# EAGLE design Caprica Charger (EAGLE 6.1)
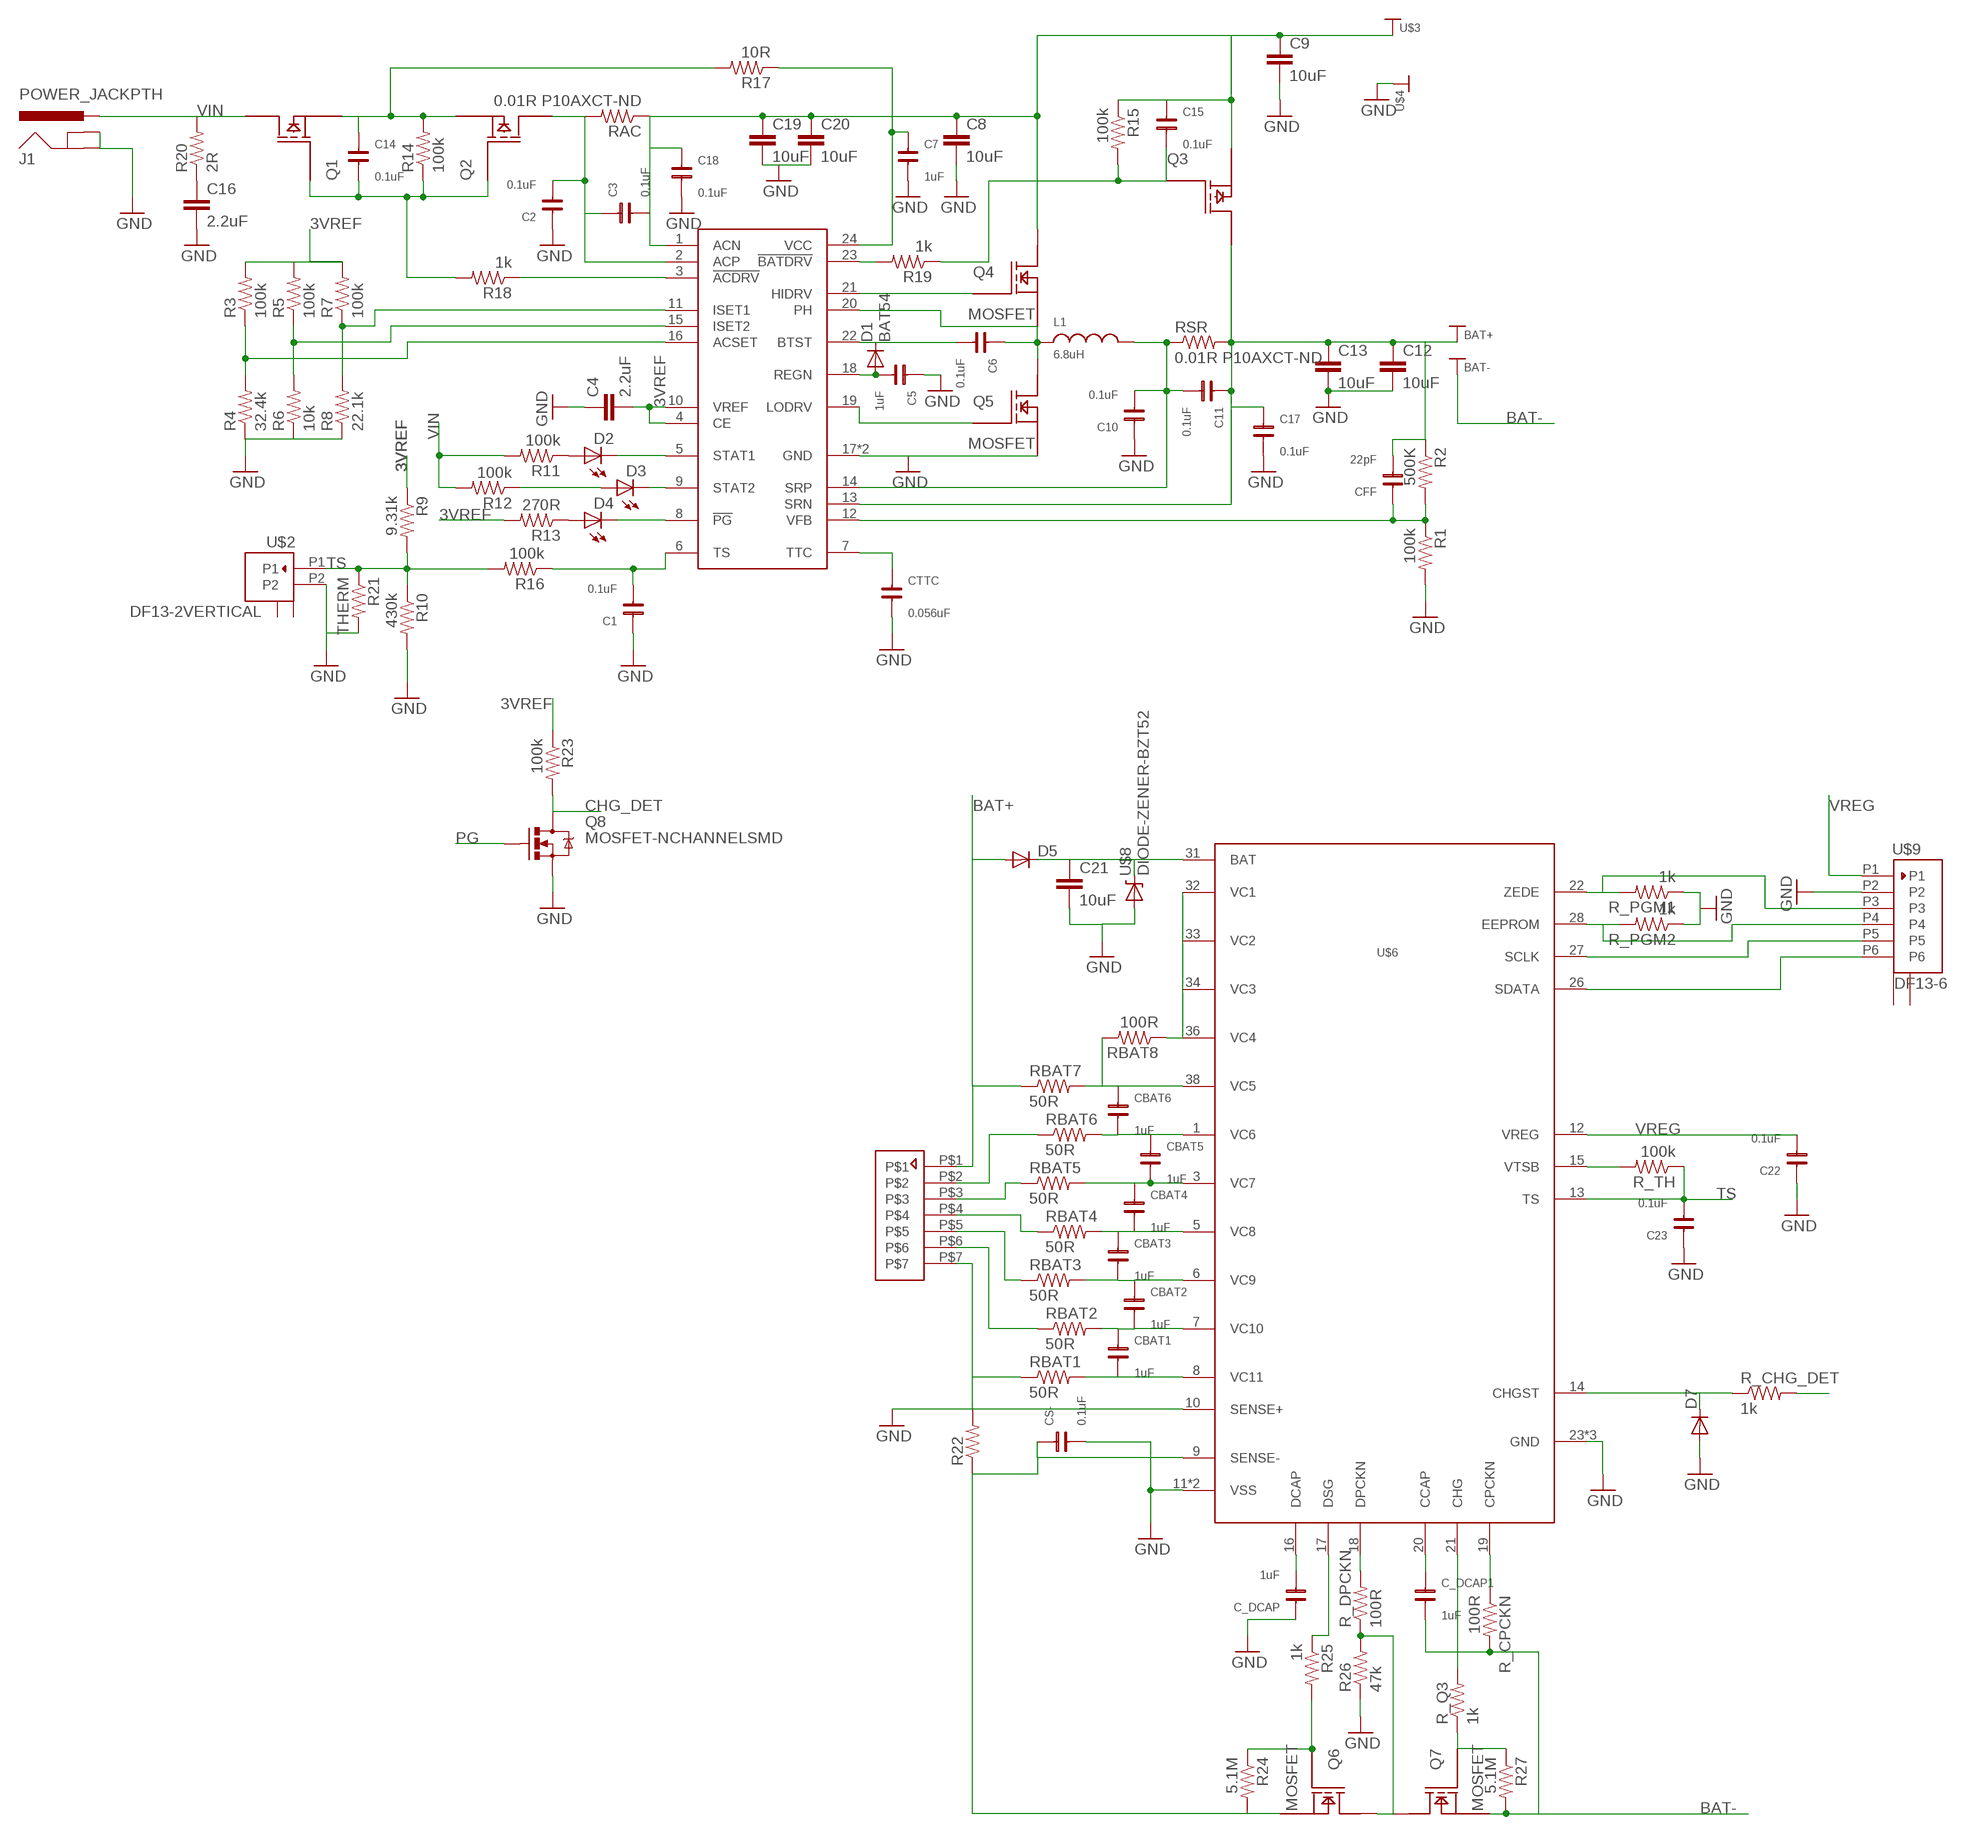
[diagram p0: schematic, sheet 1]

## Parts
BAT+  HIGHCURRENTPAD2  [HIGH_CURRENT_PAD2]
BAT-  HIGHCURRENTPAD2  [HIGH_CURRENT_PAD2]
C1  0.1uF  CAPACITOR0603-CAP  [0603-CAP]
C2  0.1uF  CAPACITOR0603-CAP  [0603-CAP]
C3  0.1uF  CAPACITOR0603-CAP  [0603-CAP]
C4  2.2uF  CAP1206  [1206]
C5  1uF  CAPACITOR0603-CAP  [0603-CAP]
C6  0.1uF  CAPACITOR0603-CAP  [0603-CAP]
C7  1uF  CAPACITOR0603-CAP  [0603-CAP]
C8  10uF  CAP1206  [1206]
C9  10uF  CAP1206  [1206]
C10  0.1uF  CAPACITOR0603-CAP  [0603-CAP]
C11  0.1uF  CAPACITOR0603-CAP  [0603-CAP]
C12  10uF  CAP1206  [1206]
C13  10uF  CAP1206  [1206]
C14  0.1uF  CAPACITOR0603-CAP  [0603-CAP]
C15  0.1uF  CAPACITOR0603-CAP  [0603-CAP]
C16  2.2uF  CAP1206  [1206]
C17  0.1uF  CAPACITOR0603-CAP  [0603-CAP]
C18  0.1uF  CAPACITOR0603-CAP  [0603-CAP]
C19  10uF  CAP1206  [1206]
C20  10uF  CAP1206  [1206]
C21  10uF  CAP1206  [1206]
C22  0.1uF  CAPACITOR0603-CAP  [0603-CAP]
C23  0.1uF  CAPACITOR0603-CAP  [0603-CAP]
C_DCAP  1uF  CAPACITOR0603-CAP  [0603-CAP]
C_DCAP1  1uF  CAPACITOR0603-CAP  [0603-CAP]
CBAT1  1uF  CAPACITOR0603-CAP  [0603-CAP]
CBAT2  1uF  CAPACITOR0603-CAP  [0603-CAP]
CBAT3  1uF  CAPACITOR0603-CAP  [0603-CAP]
CBAT4  1uF  CAPACITOR0603-CAP  [0603-CAP]
CBAT5  1uF  CAPACITOR0603-CAP  [0603-CAP]
CBAT6  1uF  CAPACITOR0603-CAP  [0603-CAP]
CFF  22pF  CAPACITOR0603-CAP  [0603-CAP]
CS-  0.1uF  CAPACITOR0603-CAP  [0603-CAP]
CTTC  0.056uF  CAPACITOR0603-CAP  [0603-CAP]
D1  BAT54  DIODESOT23  [SOT23-3]
D2  LED1206  [LED-1206]
D3  LED1206  [LED-1206]
D4  LED1206  [LED-1206]
D5  DIODESMA  [SMA-DIODE]
D7  DIODESOD  [SOD-323]
J1  POWER_JACKPTH  [POWER_JACK_PTH]
L1  6.8uH  INDUCTORSDR0403  [SDR0403_INDUCTOR]
Q1  MOSFET_PCH  [POWERPAK_1212-8]
Q2  MOSFET_PCH  [POWERPAK_1212-8]
Q3  MOSFET_PCH  [POWERPAK_1212-8]
Q4  MOSFET  [POWERPAK_1212-8]
Q5  MOSFET  [POWERPAK_1212-8]
Q6  MOSFET  [POWERPAK_1212-8]
Q7  MOSFET  [POWERPAK_1212-8]
Q8  MOSFET-NCHANNELSMD  [SOT23-3]
R1  100k  RESISTOR  [0603-RES]
R2  500K  RESISTOR  [0603-RES]
R3  100k  RESISTOR  [0603-RES]
R4  32.4k  RESISTOR  [0603-RES]
R5  100k  RESISTOR  [0603-RES]
R6  10k  RESISTOR  [0603-RES]
R7  100k  RESISTOR  [0603-RES]
R8  22.1k  RESISTOR  [0603-RES]
R9  9.31k  RESISTOR  [0603-RES]
R10  430k  RESISTOR  [0603-RES]
R11  100k  RESISTOR  [0603-RES]
R12  100k  RESISTOR  [0603-RES]
R13  270R  RESISTOR  [0603-RES]
R14  100k  RESISTOR  [0603-RES]
R15  100k  RESISTOR  [0603-RES]
R16  100k  RESISTOR  [0603-RES]
R17  10R  RESISTOR  [0603-RES]
R18  1k  RESISTOR  [0603-RES]
R19  1k  RESISTOR  [0603-RES]
R20  2R  RESISTOR  [0603-RES]
R21  THERM  RESISTOR  [0603-RES]
R22  RESISTOROHMITE  [OHMITE_FCSL64_CURRENT_SENSE_RESISTOR]
R23  100k  RESISTOR  [0603-RES]
R24  5.1M  RESISTOR  [0603-RES]
R25  1k  RESISTOR  [0603-RES]
R26  47k  RESISTOR  [0603-RES]
R27  5.1M  RESISTOR  [0603-RES]
R_CHG_DET  1k  RESISTOR  [0603-RES]
R_CPCKN  100R  RESISTOR  [0603-RES]
R_DPCKN  100R  RESISTOR  [0603-RES]
R_PGM1  1k  RESISTOR  [0603-RES]
R_PGM2  1k  RESISTOR  [0603-RES]
R_Q3  1k  RESISTOR  [0603-RES]
R_TH  100k  RESISTOR  [0603-RES]
RAC  0.01R P10AXCT-ND  RESISTOR  [0603-RES]
RBAT1  50R  RESISTOR  [0603-RES]
RBAT2  50R  RESISTOR  [0603-RES]
RBAT3  50R  RESISTOR  [0603-RES]
RBAT4  50R  RESISTOR  [0603-RES]
RBAT5  50R  RESISTOR  [0603-RES]
RBAT6  50R  RESISTOR  [0603-RES]
RBAT7  50R  RESISTOR  [0603-RES]
RBAT8  100R  RESISTOR  [0603-RES]
RSR  0.01R P10AXCT-ND  RESISTOR  [0603-RES]
U$1  BQ24610_LIPO_CHARGER  [QFN-24_ALT2]
U$2  DF13-2VERTICAL  [DF13-2-VERT]
U$3  HIGHCURRENTPAD2  [HIGH_CURRENT_PAD2]
U$4  HIGHCURRENTPAD2  [HIGH_CURRENT_PAD2]
U$6  BQ77910A_BATTERY_PROTECTOR  [TSSOP38]
U$7  JST_XH_7  [B7B-XH]
U$8  DIODE-ZENER-BZT52  [SOD-323]
U$9  DF13-6  [DF13-6-VERT]

## Nets
3VREF: C4.2 R3.2 R5.2 R7.2 R9.1 R13.2 R23.1 U$1.4(CE) U$1.10(VREF)
BAT+: BAT+.P$1 C11.1 C12.1 C13.1 C17.1 CFF.2 D5.A Q3.P5(DRAIN) Q3.P6(DRAIN) Q3.P7(DRAIN) Q3.P8(DRAIN) Q3.PAD(DRAIN) R2.1 RBAT7.1 RSR.2 U$1.13(SRN) U$7.P$1
BAT-: BAT-.P$1 C_DCAP1.2 Q7.P1(S) Q7.P2(S) Q7.P3(S) R27.2 R_CPCKN.2
CHG_DET: Q8.3(D) R23.2 R_CHG_DET.2
GND: C1.1 C2.1 C4.1 C5.1 C7.2 C8.2 C9.2 C10.1 C12.2 C13.2 C16.2 C17.2 C18.2 C19.2 C20.2 C21.2 C22.1 C23.1 C_DCAP.1 CS-.2 CTTC.2 D7.2(A) J1.GND J1.GNDBREAK Q5.P1(S) Q5.P2(S) Q5.P3(S) Q8.2(S) R1.2 R4.1 R6.1 R8.1 R10.2 R21.2 R22.P$2 R26.1 R_PGM1.1 R_PGM2.1 RBAT1.1 U$1.17(GND) U$1.EP(GND) U$2.P2 U$4.P$1 U$6.10(SENSE+) U$6.11(VSS) U$6.23(GND) U$6.24(GND) U$6.25(GND) U$6.29(VSS) U$7.P$7 U$8.2(A) U$9.P2
HIDRV: Q4.P4(G) U$1.21(HIDRV)
N$1: D2.A R11.1
N$2: C14.1 Q1.P1(SOURCE) Q1.P2(SOURCE) Q1.P3(SOURCE) Q2.P1(SOURCE) Q2.P2(SOURCE) Q2.P3(SOURCE) R14.2 R17.2
N$3: C14.2 Q1.P4(GATE) Q2.P4(GATE) R14.1 R18.2
N$4: C2.2 C3.1 Q2.P5(DRAIN) Q2.P6(DRAIN) Q2.P7(DRAIN) Q2.P8(DRAIN) Q2.PAD(DRAIN) RAC.2 U$1.2(ACP)
N$5: CBAT1.1 CBAT2.2 RBAT2.2 U$6.7(VC10)
N$6: R18.1 U$1.3(!ACDRV!)
N$7: C16.1 R20.1
N$8: C7.1 R17.1 U$1.24(VCC)
N$9: R5.1 R6.2 U$1.15(ISET2)
N$10: D2.C U$1.5(STAT1)
N$11: D3.C U$1.9(STAT2)
N$12: R25.1 U$6.17(DSG)
N$13: D3.A R12.1
N$14: D4.A R13.1
N$15: R3.1 R4.2 U$1.16(ACSET)
N$16: R7.1 R8.2 U$1.11(ISET1)
N$17: CBAT2.1 CBAT3.2 RBAT3.2 U$6.6(VC9)
N$18: C1.2 R16.1 U$1.6(TS)
N$19: CTTC.1 U$1.7(TTC)
N$20: R19.2 U$1.23(!BATDRV!)
N$21: C15.2 Q3.P4(GATE) R15.2 R19.1
N$22: CBAT3.1 CBAT4.2 RBAT4.2 U$6.5(VC8)
N$23: CBAT1.2 RBAT1.2 U$6.8(VC11)
N$24: C6.1 L1.P$1 Q4.P1(S) Q4.P2(S) Q4.P3(S) Q5.P5(D) Q5.P6(D) Q5.P7(D) Q5.P8(D) Q5.PAD(D) U$1.20(PH)
N$25: C10.2 C11.2 L1.P$2 RSR.1 U$1.14(SRP)
N$26: C6.2 D1.3(C) U$1.22(BTST)
N$27: C5.2 D1.1(A) U$1.18(REGN)
N$28: Q5.P4(G) U$1.19(LODRV)
N$29: CBAT5.1 CBAT6.2 RBAT6.2 U$6.1(VC6)
N$30: CFF.1 R1.1 R2.2 U$1.12(VFB)
N$31: CBAT4.1 CBAT5.2 RBAT5.2 U$6.3(VC7)
N$32: C_DCAP.2 U$6.16(DCAP)
N$33: CBAT6.1 RBAT7.2 RBAT8.2 U$6.38(VC5)
N$34: RBAT8.1 U$6.32(VC1) U$6.33(VC2) U$6.34(VC3) U$6.36(VC4)
N$35: C21.1 D5.C U$6.31(BAT) U$8.1(C)
N$37: D7.1(C) R_CHG_DET.1 U$6.14(CHGST)
N$38: RBAT2.1 U$7.P$6
N$39: RBAT3.1 U$7.P$5
N$40: RBAT4.1 U$7.P$4
N$41: Q6.P4(G) R24.1 R25.2
N$42: RBAT6.1 U$7.P$2
N$43: RBAT5.1 U$7.P$3
N$44: R_DPCKN.2 U$6.18(DPCKN)
N$46: Q6.P5(D) Q6.P6(D) Q6.P7(D) Q6.P8(D) Q6.PAD(D) Q7.P5(D) Q7.P6(D) Q7.P7(D) Q7.P8(D) Q7.PAD(D) R26.2 R_DPCKN.1
N$47: U$6.27(SCLK) U$9.P5
N$48: CS-.1 Q6.P1(S) Q6.P2(S) Q6.P3(S) R22.P$1 R24.2 U$6.9(SENSE-)
N$49: C_DCAP1.1 U$6.20(CCAP)
N$50: R_Q3.2 U$6.21(CHG)
N$51: Q7.P4(G) R27.1 R_Q3.1
N$52: U$6.26(SDATA) U$9.P6
N$53: R_CPCKN.1 U$6.19(CPCKN)
N$54: R_PGM2.2 U$6.28(EEPROM) U$9.P4
N$55: R_TH.2 U$6.15(VTSB)
N$57: R_PGM1.2 U$6.22(ZEDE) U$9.P3
PG: D4.C Q8.1(G) U$1.8(!PG!)
SYS+: C3.2 C8.1 C9.1 C15.1 C18.1 C19.1 C20.1 Q3.P1(SOURCE) Q3.P2(SOURCE) Q3.P3(SOURCE) Q4.P5(D) Q4.P6(D) Q4.P7(D) Q4.P8(D) Q4.PAD(D) R15.1 RAC.1 U$1.1(ACN) U$3.P$1
TS: C23.2 R9.2 R10.1 R16.2 R21.1 R_TH.1 U$2.P1 U$6.13(TS)
VIN: J1.PWR Q1.P5(DRAIN) Q1.P6(DRAIN) Q1.P7(DRAIN) Q1.P8(DRAIN) Q1.PAD(DRAIN) R11.2 R12.2 R20.2
VREG: C22.2 U$6.12(VREG) U$9.P1
Unconnected: U$2.P$6(TAB) U$2.P$7(TAB) U$9.P$6 U$9.P$7

## Library data of the parts
BAT+ BAT- U$3 U$4 = Taylor:HIGHCURRENTPAD2
C1-C3 C5-C7 C10 C11 C14 C15 C17 C18 C22 C23 C_DCAP C_DCAP1 CBAT1-CBAT6 CFF CS- CTTC = Taylor:CAPACITOR
C4 C8 C9 C12 C13 C16 C19-C21 = SparkFun:CAP: Capacitor Standard 0603 ceramic capacitor, and 0.1" leaded capacitor.
D1 D5 D7 = SparkFun:DIODE: Diode These are standard reverse protection diodes and small signal diodes. SMA package can handle up to about 1A. SOD-323 can handle about 200mA. What the SOD-323 package when ordering, there are some mfgs out there that are 5-pin packages.
D2-D4 = SparkFun:LED: LEDs Standard schematic elements and footprints for 5mm, 3mm, 1206, and 0603 sized LEDs. 5mm - Spark Fun Electronics SKU : COM-00529 (and others)
J1 = SparkFun:POWER_JACK: Power Jack This is the standard 5.5mm barrel jack for power. The PTH is the most common, proven, reliable, footprint. All others are experimental. The Slot footprint only works if the mill layer is transmitted to the PCB fab house so be warned. Spark Fun Electronics SKU : PRT-00119. Mating wall wart : TOL-00298 (and others)
L1 = Taylor:INDUCTOR: SRR1260_SMD_INDUCTOR http://www.bourns.com/data/global/PDFs/SRR1260.pdf 1uH-1000uH
Q1-Q3 = Taylor:MOSFET_PCH
Q4-Q7 = Taylor:MOSFET
Q8 = SparkFun:MOSFET-NCHANNEL
R1-R27 R_CHG_DET R_CPCKN R_DPCKN R_PGM1 R_PGM2 R_Q3 R_TH RAC RBAT1-RBAT8 RSR = Taylor:RESISTOR: Resistor Basic schematic elements and footprints for 0603, 1206, and PTH 1/10th watt (small) resistors.
U$1 = Taylor:BQ24610_LIPO_CHARGER
U$2 = Taylor:DF13-2
U$6 = Taylor:BQ77910A_BATTERY_PROTECTOR
U$7 = Taylor:JST_XH_7
U$8 = SparkFun:DIODE-ZENER: Zener Diode Production Part - 8199 3.4V Zener Voltage
U$9 = Taylor:DF13-6

## Board
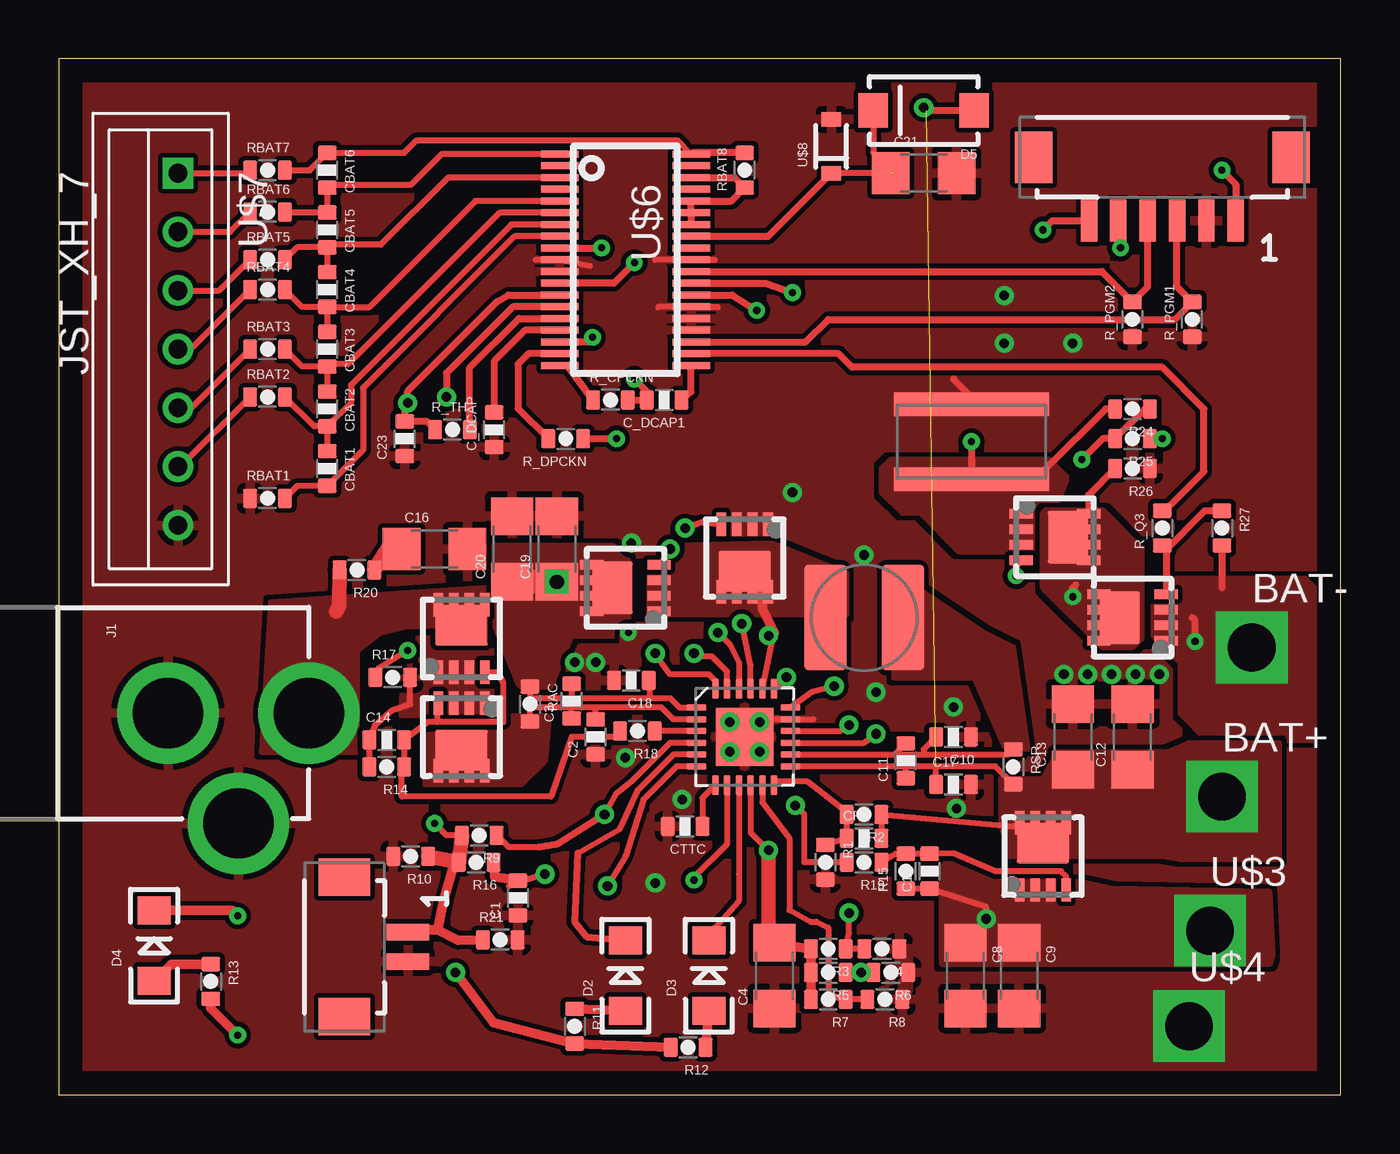
[diagram p1: board, top side]
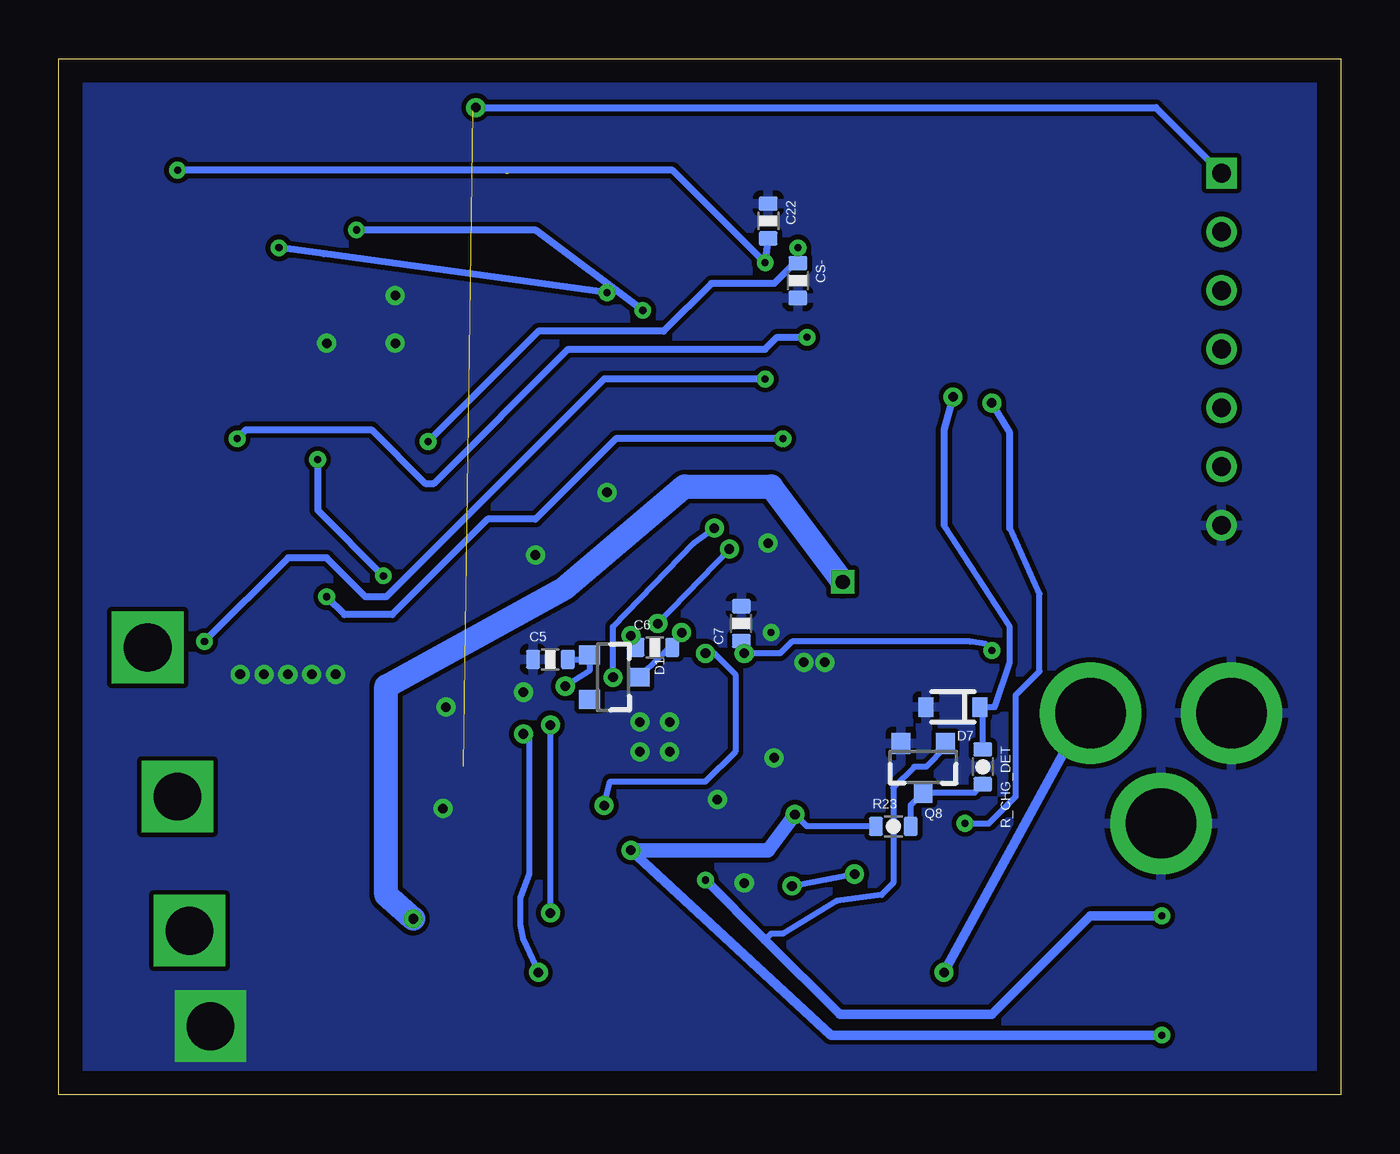
[diagram p2: board, bottom side, seen from below]

Size 54.59 x 44.12 mm. Coordinates in mm from the lower left corner, seen from the top.
Outline: 0,0 54.59,0 54.59,44.12 0,44.12 0,0
Copper layers (1*16): Top 0.035mm / dielectric 1.5mm / Bottom 0.035mm
Design rules: minimum track width 10mil, minimum drill 24mil, track to track 8mil, track to pad 8mil, pad to pad 8mil, via to via 8mil, smd to smd 8mil, copper to edge 40mil, drill to drill 8mil, minimum pad ring 10mil, minimum via ring 8mil, stop-mask expansion 4mil, vias tented up to drill 0mil, thermal gap 10mil

### Footprints (pad centres in the part's own frame; a part is rotated, then mirrored left to right if it is on the bottom)
HIGH_CURRENT_PAD2 = drill 2.032 pad 2.54 square: P$1 0,0
0603-CAP = smd 0.6 x 0.8: 1 -0.74,0; 2 0.74,0
1206 = smd 1.6 x 1.8: 1 -1.4,0; 2 1.4,0
SOT23-3 = smd 0.8 x 0.9: 1 -0.95,-1; 2 0.95,-1; 3 0,1.1
LED-1206 = smd 1.2 x 1.4: A -1.5,0; C 1.5,0
SMA-DIODE = smd 1.27 x 1.47: A -2.15,0; C 2.15,0
SOD-323 = smd 0.63 x 0.83: 1 -1.15,0; 2 1.15,0
POWER_JACK_PTH = drill 2.997 pad 4.318: GND 0,7.7; GNDBREAK 4.7,10.7; PWR 0,13.7
SDR0403_INDUCTOR = smd 1.803 x 4.496: P$1 -1.651,0; P$2 1.651,0
POWERPAK_1212-8 = smd 0.405 x 0.99: P1 0.99,1.435; P2 0.33,1.435; P3 -0.33,1.435; P4 -0.99,1.435; P5 -0.99,-1.435; P6 -0.33,-1.435; P7 0.33,-1.435; P8 0.99,-1.435 | smd 2.235 x 1.725: PAD 0,-0.557
0603-RES = smd 0.6 x 0.8: 1 -0.74,0; 2 0.74,0
OHMITE_FCSL64_CURRENT_SENSE_RESISTOR = smd 1 x 6.6: P$1 -1.6,0; P$2 1.6,0
QFN-24_ALT2 = smd 0.85 x 0.28: 1 -2.05,1.25; 2 -2.05,0.75; 3 -2.05,0.25; 4 -2.05,-0.25; 5 -2.05,-0.75; 6 -2.05,-1.25; 13 1.95,-1.25; 14 1.95,-0.75; 15 1.95,-0.25; 16 1.95,0.25; 17 1.95,0.75; 18 1.95,1.25 | smd 0.28 x 0.85: 7 -1.25,-2.05; 8 -0.75,-2.05; 9 -0.25,-2.05; 10 0.25,-2.05; 11 0.75,-2.05; 12 1.25,-2.05; 19 1.25,2.05; 20 0.75,2.05; 21 0.25,2.05; 22 -0.25,2.05; 23 -0.75,2.05; 24 -1.25,2.05 | smd 2.45 x 2.45: EP 0,0
DF13-2-VERT = smd 1.8 x 0.7: P1 -0.9,-0.575; P2 -0.9,0.675 | smd 2.2 x 1.6: P$6 1.8,3.025; P$7 1.8,-2.925
TSSOP38 = smd 0.3 x 1.6: 1 -4.5,-2.8; 2 -4,-2.8; 3 -3.5,-2.8; 4 -3,-2.8; 5 -2.5,-2.8; 6 -2,-2.8; 7 -1.5,-2.8; 8 -1,-2.8; 9 -0.5,-2.8; 10 0,-2.8; 11 0.5,-2.8; 12 1,-2.8; 13 1.5,-2.8; 14 2,-2.8; 15 2.5,-2.8; 16 3,-2.8; 17 3.5,-2.8; 18 4,-2.8; 19 4.5,-2.8; 20 4.5,2.8; 21 4,2.8; 22 3.5,2.8; 23 3,2.8; 24 2.5,2.8; 25 2,2.8; 26 1.5,2.8; 27 1,2.8; 28 0.5,2.8; 29 0,2.8; 30 -0.5,2.8; 31 -1,2.8; 32 -1.5,2.8; 33 -2,2.8; 34 -2.5,2.8; 35 -3,2.8; 36 -3.5,2.8; 37 -4,2.8; 38 -4.5,2.8
B7B-XH = drill 0.8 square: P$1 -7.5,0 | drill 0.8: P$2 -5,0; P$3 -2.5,0; P$4 0,0; P$5 2.5,0; P$6 5,0; P$7 7.5,0
DF13-6-VERT = smd 1.8 x 0.7: P1 -2.15,-3.125; P2 -2.15,-1.875; P3 -2.15,-0.625; P4 -2.15,0.625; P5 -2.15,1.875; P6 -2.15,3.125 | smd 2.2 x 1.6: P$6 0.55,5.475; P$7 0.55,-5.475

### Placement (x,y rotation side)
BAT+  49.53,12.7 0 top
BAT-  50.8,19.05 0 top
C1  19.56,8.38 90 top
C2  22.86,15.24 90 top
C3  21.84,16.76 90 top
C4  30.48,5.08 90 top
C5  33.66,18.54 0 bottom
C6  29.21,19.05 0 bottom
C7  25.53,20.07 90 bottom
C8  38.61,5.08 270 top
C9  40.89,5.08 270 top
C10  38.1,15.24 180 top
C11  36.07,14.22 90 top
C12  45.72,15.24 90 top
C13  43.18,15.24 90 top
C14  13.97,15.11 0 top
C15  37.08,9.53 90 top
C16  16,23.24 0 top
C17  38.1,13.21 0 top
C18  24.38,17.65 180 top
C19  21.21,23.24 90 top
C20  19.3,23.24 90 top
C21  36.83,39.24 0 top
C22  24.38,37.21 270 bottom
C23  14.73,27.94 90 top
C_DCAP  18.54,28.32 90 top
C_DCAP1  25.78,29.59 180 top
CBAT1  11.43,26.67 270 top
CBAT2  11.43,29.21 270 top
CBAT3  11.43,31.75 270 top
CBAT4  11.43,34.29 270 top
CBAT5  11.43,36.83 270 top
CBAT6  11.43,39.37 270 top
CFF  34.29,10.92 0 top
CS-  23.11,34.67 270 bottom
CTTC  26.67,11.43 180 top
D1  30.99,17.78 270 bottom
D2  24.13,5.08 90 top
D3  27.69,5.08 90 top
D4  4.06,6.35 90 top
D5  36.83,41.91 180 top
D7  16.51,16.51 180 bottom
J1  -3.05,16.26 270 top
L1  34.29,20.32 0 top
Q1  17.14,19.43 180 top
Q2  17.14,15.24 0 top
Q3  41.91,10.16 180 top
Q4  24.13,21.59 270 top
Q5  29.21,22.86 0 top
Q6  42.42,23.75 90 top
Q7  45.72,20.32 270 top
Q8  17.78,13.97 180 bottom
R1  32.64,9.91 270 top
R2  34.29,11.94 180 top
R3  32.77,6.22 180 top
R4  35.05,6.22 180 top
R5  32.77,5.21 180 top
R6  35.43,5.21 180 top
R7  32.77,4.06 180 top
R8  35.18,4.06 180 top
R9  17.91,11.05 180 top
R10  14.99,10.16 180 top
R11  21.97,2.92 270 top
R12  26.8,2.03 180 top
R13  6.48,4.83 270 top
R14  13.97,13.97 180 top
R15  36.07,9.53 90 top
R16  17.78,9.91 180 top
R17  14.22,17.78 0 top
R18  24.64,15.49 180 top
R19  34.29,9.91 180 top
R20  12.7,22.35 180 top
R21  18.8,6.6 0 top
R22  38.86,27.81 90 top
R23  19.05,11.43 0 bottom
R24  45.72,29.21 180 top
R25  45.72,27.94 180 top
R26  45.72,26.67 180 top
R27  49.53,24.13 270 top
R_CHG_DET  15.24,13.97 270 bottom
R_CPCKN  23.5,29.59 0 top
R_DPCKN  21.59,27.94 180 top
R_PGM1  48.26,33.02 90 top
R_PGM2  45.72,33.02 90 top
R_Q3  46.99,24.13 90 top
R_TH  16.76,28.32 0 top
RAC  20.07,16.64 270 top
RBAT1  8.89,25.4 0 top
RBAT2  8.89,29.72 0 top
RBAT3  8.89,31.75 0 top
RBAT4  8.89,34.29 0 top
RBAT5  8.89,35.56 0 top
RBAT6  8.89,37.59 0 top
RBAT7  8.89,39.37 0 top
RBAT8  29.21,39.37 90 top
RSR  40.64,13.97 270 top
U$1  29.21,15.24 0 top
U$2  13.97,6.35 180 top
U$3  49.02,6.99 0 top
U$4  48.13,2.92 0 top
U$6  24.13,35.56 270 top
U$7  5.08,31.75 270 top
U$8  32.89,40.39 90 top
U$9  46.99,39.37 90 top

### Tracks (layer width: path | path; a pad name or v marks a point on that pad's centre or on a via)
3VREF  (via drill 0.3, 0.41)
  Top 0.254: U$1.4 26.04,14.99 24.38,13.34 23.75,12.83 v23.24,11.94 | U$1.10 29.46,11.18 v30.23,10.41 | 20.45,10.54 19.18,10.54 18.67,11.05 R9.1
  Top 0.305: v23.24,11.94 21.21,10.67 20.45,10.54
  Top 0.406: R7.2 R5.2 R3.2 31.9,6.23 C4.2 | R13.2 6.48,3.68 v7.62,2.54
  Top 0.61: C4.2 30.42,6.11 30.23,6.73 v30.23,10.41
  Bottom 0.254: R23.1 22.73,11.43 v23.24,11.94
  Bottom 0.406: v7.62,2.54 21.72,2.54 v30.23,10.41
  Bottom 0.61: v30.23,10.41 24.38,10.41 v23.24,11.94
BAT+  (via drill 0.41)  (1 unrouted)
  Top 0.254: RSR.2 39.88,13.99 37.36,13.99 | 37.36,13.99 36.07,13.99 | 36.07,13.99 U$1.13 | C11.1 36.07,13.99 | C17.1 37.36,13.99 | 40.64,11.43 R2.1 CFF.2 | U$7.P$1 8.03,39.25 RBAT7.1
  Top 0.305: D5.A 36.96,41.91 v36.83,42.04
  Bottom 0.305: v36.83,42.04 7.87,42.04 U$7.P$1
  pour Top (no thermals): 40.13,13.46 41.91,13.46 42.55,14.61 42.55,14.48 42.67,14.61 47.24,14.61 48.13,14.99 51.94,14.99 51.94,10.03 47.75,10.03 46.99,10.16 40.51,10.16 40.13,11.56
BAT-  (via drill 0.3)
  Top 0.305: R27.2 49.53,21.59 | R_CPCKN.2 C_DCAP1.2 25.04,29.95 v24.51,30.48 | v48.39,19.3 48.39,20.19 48.26,20.32
  Bottom 0.305: v24.51,30.48 31.37,30.48 40.64,21.21 41.53,21.21 43.18,22.86 44.83,22.86 v48.39,19.3
  pour Top (rank 2, no thermals): 46.61,21.72 46.61,19.56 47.75,18.41 47.75,16.26 48.9,15.11 53.98,15.11 54.23,15.37 54.23,20.83 53.09,21.97 46.86,21.97
CHG_DET
  Bottom 0.254: R23.2 18.31,12.34 Q8.3 15.6,12.87 R_CHG_DET.2
GND  (via drill 0.3, 0.41)
  Top 0.254: 32.13,16 U$1.17 31.13,15.99 31.11,16 | v29.84,15.88 30.35,16 31.11,16 | 31.11,16 31.24,16 | U$1.EP v28.57,14.61 | 20.32,35.56 U$6.10 22.61,35.31 | 25.4,35.56 U$6.29 27.94,35.56 | 28.07,33.53 28.04,33.56 U$6.25 25.56,33.56 25.53,33.53
  Top 0.305: R22.P$2 38.86,29.72 38.1,30.48
  other vias: 38.1,16.51 28.57,15.88 29.84,14.61 38.23,12.19 21.97,18.41 24.26,19.68 22.86,18.41 26.54,12.57 25.4,9.02 34.29,22.99 31.24,25.65 24.13,14.35 24.38,23.5 34.8,17.14 42.8,17.91 43.81,17.91 44.83,17.91 45.85,17.91 46.86,17.91 40.26,32 43.18,32 40.26,34.04
  pour Bottom (rank 2): 0,0 54.61,0 54.61,44.45 0,44.45
  pour Top (rank 3): 0,0 77.47,0 77.47,58.42 0,58.42
HIDRV  (via drill 0.41)
  Top 0.254: U$1.21 29.46,18.29 v29.08,20.07 | v26.04,23.24 25.97,22.99 Q4.P4
  Bottom 0.254: v29.08,20.07 v26.04,23.24
N$1
  Top 0.406: D2.A R11.1
N$2
  Top 0.254: R14.2 C14.1 13.48,15.77 14.22,16.38 14.96,16.64 R17.2
  pour Top: 14.73,19.43 18.41,19.56 18.41,16.26 14.61,16.13
N$3
  Top 0.254: Q1.P4 18.71,18 18.92,17.53 18.92,15.88 16.13,15.88 | 16.13,15.88 16.13,16.51 | 16.13,16.51 16.13,16.64 | Q2.P4 16.16,16.64 16.13,16.51 | 16.13,15.88 15.73,15.88 C14.2 R14.1 14.61,14.07 14.61,12.7 20.95,12.7 21.84,15.24 23.62,15.24 R18.2
N$4
  Top 0.254: RAC.2 20.07,16.51 21.84,16.51 | 21.84,16.51 22.86,16.51 | 22.86,16.51 25.65,16.51 26.16,16 27.15,16 U$1.2 | C3.1 21.84,16.51 | C2.2 22.86,16.51
  pour Top (no thermals): 15.62,15.37 18.16,15.24 19.05,16.13 20.83,16.13 20.83,15.75 20.7,14.22 19.68,13.21 15.62,13.21
N$5
  Top 0.254: CBAT2.2 10.88,28.47 RBAT2.2 | CBAT2.2 CBAT1.1 | U$6.7 19.28,37.06 12.45,30.23 12.45,29.49 CBAT2.2
N$6
  Top 0.254: U$1.3 25.4,15.49 25.5,15.47 | R18.1 25.5,15.47 | 25.5,15.47 25.53,15.62
N$7
  Top 0.61: R20.1 14.33,23.75 C16.1
N$8  (via drill 0.3, 0.41)
  Top 0.254: U$1.24 27.96,17.63 27.69,17.91 26.04,17.91 v25.4,18.8 | v14.86,18.92 13.61,18.16 R17.1
  Bottom 0.254: C7.1 25.53,18.95 v25.4,18.8 23.88,18.8 23.37,19.3 15.79,19.3 15.13,19.2 v14.86,18.92
N$9  (via drill 0.41)
  Top 0.254: U$1.15 34.29,14.99 v34.8,15.37 | R6.2 v34.16,5.21 R5.1
  Bottom 0.254: v34.16,5.21 34.8,6.6 34.92,7.24 34.92,8.38 34.54,9.4 34.54,15.11 v34.8,15.37
N$10
  Top 0.254: U$1.5 26.17,14.49 24.64,12.95 23.88,11.3 22.1,10.29
  Top 0.305: 22.1,10.29 21.97,7.37 22.48,6.73 D2.C 24.13,6.86
N$11
  Top 0.254: U$1.9 28.96,9.39 28.96,8.26 27.94,7.11 D3.C
N$12  (via drill 0.3)
  Top 0.305: R25.1 v46.99,27.94 | v22.73,32.26 22.54,32.06 U$6.17
  Bottom 0.305: v46.99,27.94 46.61,28.32 41.27,28.32 38.99,26.04 38.61,26.04 32.89,31.75 24.51,31.75 24,32.26 v22.73,32.26
N$13
  Top 0.406: D3.A R12.1
N$14
  Top 0.406: R13.1 4.78,5.57 D4.A
N$15  (via drill 0.41)
  Top 0.254: U$1.16 33.27,15.49 v33.66,15.75 | R4.2 R3.1 33.66,6.88 v33.66,7.75
  Bottom 0.254: v33.66,7.75 v33.66,15.75
N$16
  Top 0.254: U$1.11 29.96,12.46 31.11,10.92 31.11,7.87 32,7.37 32.26,7.37 32.77,7.11 32.77,4.32 33.4,4.06 R7.1 R8.2
N$17
  Top 0.254: CBAT3.2 10.37,31.01 RBAT3.2 | CBAT3.2 CBAT2.1 | U$6.6 18.76,37.56 12.32,31.11 11.54,31.11 CBAT3.2
N$18  (via drill 0.41)
  Top 0.254: U$1.6 26.31,13.99 24.89,12.57 24.13,10.16 v23.37,8.89 | v20.7,9.4 19.16,8.89 C1.2
  Top 0.406: C1.2 18.56,9.27 R16.1
  Bottom 0.254: v23.37,8.89 v20.7,9.4
N$19
  Top 0.254: U$1.7 27.41,12.64 CTTC.1
N$20  (via drill 0.41)
  Top 0.254: U$1.23 28.46,18.02 27.81,18.67 27.18,18.67 v27.05,18.8 | R19.2 33.42,9.88 33.53,9.91 31.75,9.91 31.75,11.94 v31.37,12.32
  Bottom 0.254: v27.05,18.8 26.67,18.8 25.78,17.91 25.78,14.61 27.05,13.34 31.11,13.34 v31.37,12.32
N$21
  Top 0.254: Q3.P4 42.9,9.3 42.67,9.53 39.88,9.53 38.1,10.29 C15.2 R15.2 35.64,10.27 R19.1
N$22
  Top 0.254: CBAT4.2 10.37,33.55 RBAT4.2 | CBAT4.2 CBAT3.1 | U$6.5 17.74,38.06 13.21,33.53 11.45,33.53 CBAT4.2
N$23
  Top 0.254: RBAT1.2 10.16,25.93 CBAT1.2 12.95,27.45 12.95,30.1 19.41,36.56 U$6.8
N$24  (via drill 0.41)
  Top 0.254: U$1.20 30.42,19.46 | 30.42,19.46 30.47,19.67 | v30.23,19.56 30.33,19.56 30.42,19.46
  Top 0.406: 30.47,19.67 29.96,20.69 29.97,21.59
  Bottom 0.254: C6.1 29.95,19.54 v30.23,19.56
  pour Top (no thermals): 33.53,20.45 25.15,20.45 25.15,21.59 25.27,23.37 30.35,23.5 33.53,22.23
N$25
  Top 0.254: RSR.1 40.41,14.48 36.83,14.48 | 36.83,14.48 35.56,14.48 | 35.56,14.48 31.17,14.48 U$1.14 | C10.2 36.83,14.71 36.83,14.48 | C11.2 35.56,14.48
  pour Top (no thermals): 35.56,22.23 35.56,17.78 38.99,17.78 40.26,14.86 41.27,14.73 40.64,19.05 39.37,19.68
N$26  (via drill 0.41)
  Top 0.254: v28.07,19.68 28.57,19.18 28.96,18.41 28.96,17.78 U$1.22
  Bottom 0.254: D1.3 28.96,18.67 28.55,19.14 | 28.55,19.14 v28.07,19.68 | C6.2 28.55,19.14
N$27  (via drill 0.41)
  Top 0.254: v33.02,17.4 32.07,17.14 U$1.18
  Bottom 0.254: v33.02,17.4 31.99,18.05 D1.1 32.18,18.54 C5.2
N$28  (via drill 0.41)
  Top 0.254: U$1.19 30.5,17.29 v30.99,17.78 | v26.67,24.13 27.37,24.38 Q5.P4
  Bottom 0.254: v30.99,17.78 30.99,19.94 27.56,23.5 v26.67,24.13
N$29
  Top 0.254: RBAT6.2 9.65,37.57 CBAT5.1 CBAT6.2 11.54,38.73 14.99,38.73 16.31,40.06 U$6.1
N$30
  Top 0.254: U$1.12 30.61,13.34 31.88,13.34 33.55,12.04 R2.2 CFF.1 R1.1
N$31
  Top 0.254: CBAT5.2 CBAT4.1 | CBAT5.2 10.16,36.09 RBAT5.2 | U$6.3 16.58,39.06 13.72,36.2 11.54,36.2 CBAT5.2
N$32
  Top 0.305: U$6.16 19.86,32.56 18.54,31.24 C_DCAP.2
N$33
  Top 0.254: RBAT7.2 10.69,39.37 CBAT6.1 14.71,40.11 15.24,40.64 26.35,40.64 U$6.38
  Top 0.305: RBAT8.2 26.98,40.11 U$6.38
N$34
  Top 0.305: U$6.36 28.78,39.06 RBAT8.1 28.64,38.06 U$6.34 U$6.33 U$6.32
N$35  (1 unrouted)
  Top 0.254: D5.C 34.68,40.12 35.56,39.24 U$8.1
  Top 0.305: U$6.31 30.22,36.56 U$8.1
N$37  (via drill 0.41)
  Top 0.305: U$6.14 19.34,33.56 16.51,30.73 v16.51,29.72
  Bottom 0.254: R_CHG_DET.1 15.24,16.39 D7.1 14.73,16.51 14.1,18.41 14.1,19.94 16.89,24.26
  Bottom 0.305: v16.51,29.72 16.89,28.32 16.89,24.26
N$38
  Top 0.254: U$7.P$6 5.18,26.75 RBAT2.1
N$39
  Top 0.254: U$7.P$5 5.65,29.25 RBAT3.1
N$40
  Top 0.254: U$7.P$4 5.61,31.75 RBAT4.1
N$41  (via drill 0.3)
  Top 0.305: v43.56,27.05 44.45,27.94 R25.2 46.25,29.21 R24.1 | v40.77,22.1 40.77,22.54 Q6.P4
  Bottom 0.305: v43.56,27.05 43.56,24.89 v40.77,22.1
N$42
  Top 0.254: U$7.P$2 7.31,36.75 RBAT6.1
N$43
  Top 0.254: U$7.P$3 6.84,34.25 RBAT5.1
N$44
  Top 0.305: U$6.18 20,31.56 19.56,31.11 19.56,29.23 R_DPCKN.2
N$46  (via drill 0.3)
  Top 0.305: R26.2 43.85,25.54 Q6.P8 | R_DPCKN.1 v23.75,27.94 | v43.18,21.21 43.18,21.59 43.31,21.72
  Bottom 0.305: v23.75,27.94 30.86,27.94 34.29,24.51 36.32,24.51 40.39,20.45 42.42,20.45 v43.18,21.21
  pour Top: 45.72,19.05 44.45,19.05 41.91,21.59 41.91,24.77 42.04,24.89 44.45,24.89 46.1,23.24 46.1,19.43
N$47  (via drill 0.3)
  Top 0.305: U$6.27 30.08,34.56 v31.24,34.16 | v45.21,36.07 45.21,37.12 U$9.P5
  Bottom 0.305: v31.24,34.16 43.31,35.81 v45.21,36.07
N$48  (via drill 0.3)
  Top 0.305: U$6.9 v23.11,36.06 v23.11,36.07 | R24.2 44.58,29.21 42.04,26.67 | v38.86,27.81 38.86,26.54 38.73,26.42
  Bottom 0.305: v23.11,36.07 CS-.1 23.26,35.41 24.13,34.54 26.8,34.54 28.83,32.51 34.16,32.51 v38.86,27.81
  pour Top (rank 2): 41.66,23.11 38.35,23.11 36.7,24.77 35.94,24.77 35.05,25.65 35.05,26.67 35.43,27.05 42.16,27.05 42.93,26.29
N$49
  Top 0.305: C_DCAP1.1 26.93,29.94 U$6.20
N$50
  Top 0.305: R_Q3.2 47.09,24.87 48.77,26.54 48.77,29.21 46.99,30.99 33.78,30.99 33.21,31.56 U$6.21
N$51
  Top 0.305: R_Q3.1 47.16,23.23 | 47.16,23.23 Q7.P4 | 47.16,23.23 48.8,24.87 R27.1
N$52  (via drill 0.3)
  Top 0.305: U$6.26 28.68,34.06 v29.72,33.4 | v41.91,36.83 42.3,37.22 U$9.P6
  Bottom 0.305: v29.72,33.4 34.29,36.83 v41.91,36.83
N$53
  Top 0.305: R_CPCKN.1 21.67,31.06 U$6.19
N$54
  Top 0.305: U$6.28 44.42,35.06 R_PGM2.2 46.37,34.41 U$9.P4
N$55
  Top 0.305: R_TH.2 17.5,30.97 19.6,33.06 U$6.15
N$57
  Top 0.305: U$6.22 31.81,32.06 32.77,33.02 47.52,33.02 R_PGM1.2 47.62,34.41 U$9.P3
PG  (via drill 0.3)
  Top 0.254: U$1.8 28.45,13.18 28.45,10.67 27.05,9.27 v27.05,9.14
  Top 0.406: D4.C 7.39,7.85 v7.62,7.62
  Bottom 0.254: Q8.1 16.83,14.79 17.65,13.97 18.16,13.97 19.05,13.08 19.05,9.02 19.56,8.51 21.46,8.26 23.75,6.86 24.26,6.86 24.51,6.6
  Bottom 0.406: v7.62,7.62 10.67,7.62 14.86,3.43 21.34,3.43 24.51,6.6 v27.05,9.14
SYS+  (via drill 0.41, 0.6)
  Top 0.254: RAC.1 20.07,16.89 21.84,16.89 | 21.84,16.89 25.15,16.89 | 25.15,16.89 26.04,16.89 26.44,16.49 U$1.1 | C3.2 21.84,16.89 | C18.1 25.15,17.25 25.15,16.89 | R15.1 C15.1 39.48,8.02 39.5,7.37
  Top 1.016: C19.1 C20.1
  Bottom 1.016: v39.5,7.49 40.64,8.51 40.64,17.4 33.02,21.59 27.94,25.91 24.26,25.91 C19.1
  other vias: 21.21,21.84
  pour Top (no thermals): 19.68,17.4 20.95,17.4 21.84,19.56 23.62,19.56 24.26,20.19 24.26,22.73 23.62,23.37 18.54,23.37 18.54,20.07 19.56,17.53
  pour Top (no thermals): 44.83,8.76 43.05,9.14 37.59,10.16 37.59,5.59 51.56,5.59 51.69,5.97 51.56,8.64
TS  (via drill 0.3, 0.41)
  Top 0.254: R9.2 16.51,11.05 v16,11.56
  Top 0.305: U$6.13 19.15,34.06 18.67,33.78 14.86,29.97 v14.86,29.46 14.73,29.34 C23.2 15.66,28.68 R_TH.1
  Top 0.406: R9.2 16.39,8.27 16.12,7.03 | R21.1 17.01,6.58 16.12,7.03 | 16.12,7.03 14.97,7.03 U$2.P1
  Top 0.61: R9.2 R16.2 R10.1
  Bottom 0.254: v16,11.56 14.99,11.56 13.84,12.7 13.84,17.02 12.83,18.03 12.83,21.34 14.1,24.13
  Bottom 0.305: 14.1,24.13 14.1,28.19 v14.86,29.46
VIN  (via drill 0.41)
  Top 0.406: R12.2 R11.2 18.52,3.07 v16.89,5.21
  Top 0.61: R20.2 11.94,20.81 11.81,20.57
  Bottom 0.406: v16.89,5.21 11.43,15.24 11.16,15.51 J1.PWR
  pour Top (rank 2, no thermals): 12.7,18.92 13.72,19.68 14.73,19.94 18.03,20.07 18.16,21.59 9.02,20.95 8.64,14.61 12.7,14.61
VREG  (via drill 0.3)
  Top 0.305: v24.51,35.43 23.64,34.56 U$6.12 | v49.53,39.37 50.12,38.78 U$9.P1
  Bottom 0.305: C22.2 v24.51,35.43 28.45,39.37 v49.53,39.37